# EAGLE design micon_sensor (EAGLE 9.0.0)
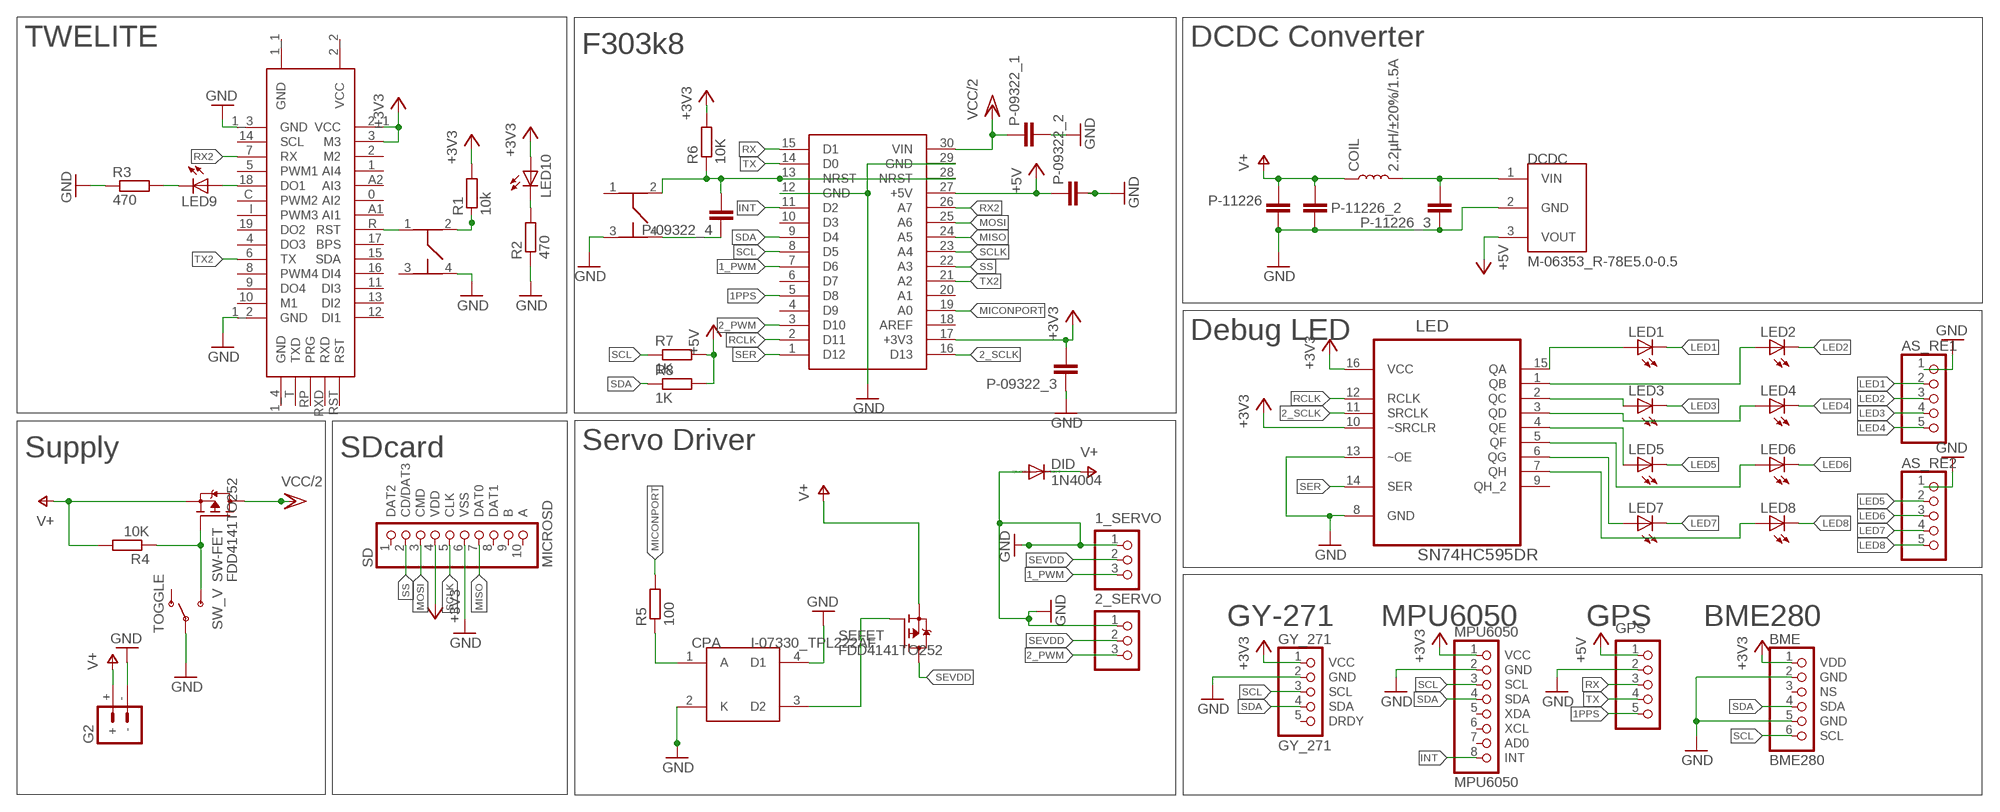
[diagram p0: schematic, sheet 1]

## Parts
1_SERVO  B3B-XH-A  [B3B-XH-A]
2_SERVO  B3B-XH-A  [B3B-XH-A]
AS_RE1  PINHD-1X5  [1X05]
AS_RE2  PINHD-1X5  [1X05]
BME  BME280  [1X06]
COIL  2.2µH/±20%/1.5A  INDUCTOR-VLF4012AT-2.2UH  [INDUCTOR_2.2UH]
CPA  I-07330_TPL222AF  [TLP222AF]
DCDC  M-06353_R-78E5.0-0.5  [R-78E5.0-0.5]
DID  1N4004  [DO41-10]
G2  BATTERY_CONN_DEANS  [DEANS]
GPS  B5B-XH-A  [B5B-XH-A]
GY_271  GY_271  [1X05]
LED  SN74HC595DR  [SOIC127P600X175-16N]
LED1  LEDCHIP-LED0603  [CHIP-LED0603]
LED2  LEDCHIP-LED0603  [CHIP-LED0603]
LED3  LEDCHIP-LED0603  [CHIP-LED0603]
LED4  LEDCHIP-LED0603  [CHIP-LED0603]
LED5  LEDCHIP-LED0603  [CHIP-LED0603]
LED6  LEDCHIP-LED0603  [CHIP-LED0603]
LED7  LEDCHIP-LED0603  [CHIP-LED0603]
LED8  LEDCHIP-LED0603  [CHIP-LED0603]
LED9  LEDCHIP-LED0603  [CHIP-LED0603]
LED10  LEDCHIP-LED0603  [CHIP-LED0603]
MPU6050  MPU6050  [1X08]
P-09322_1  C-EUC0805  [C0805]
P-09322_2  C-EUC0805  [C0805]
P-09322_3  C-EUC0805  [C0805]
P-09322_4  C-EUC0805  [C0805]
P-11226  C-EUC0805  [C0805]
P-11226_2  C-EUC0805  [C0805]
P-11226_3  C-EUC0805  [C0805]
R1  10k  R-EU_R0805  [R0805]
R2  470  R-EU_R0805  [R0805]
R3  470  R-EU_R0805  [R0805]
R4  10K  R-EU_R0805  [R0805]
R5  100  R-EU_R0805  [R0805]
R6  10K  R-EU_R0805  [R0805]
R7  1K  R-EU_R0805  [R0805]
R8  1K  R-EU_R0805  [R0805]
SD  MICROSD  [1X10]
SEFET  FDD4141TO252  [TO252]
SW-FET  FDD4141TO252  [TO252]
SW_MI  SWITCH  [SWITCH]
SW_V  TOGGLE  [320-916]
TWE_SW  SWITCH  [SWITCH]
U$1  TWELITE  [TWELITE_DIP]
U$3  STM32F303K8  [STM32F303K8]

## Nets
1_PWM: 1_SERVO.3 U$3.7(D6)
1PPS: GPS.5 U$3.5(D8)
2_PWM: 2_SERVO.3 U$3.3(D10)
2_SCLK: LED.11(SRCLK) U$3.16(D13)
+3V3: BME.1(VDD) GY_271.1(VCC) LED10.A LED.10(~SRCLR) LED.16(VCC) MPU6050.1(VCC) P-09322_3.2 R1.2 R6.2 SD.4(VDD) U$1.2_1(VCC) U$1.3(M3) U$3.17(+3V3)
+5V: DCDC.3(VOUT) GPS.1 P-09322_2.1 R7.2 R8.2 U$3.27(+5V)
GND: 1_SERVO.1 2_SERVO.1 AS_RE1.1 AS_RE2.1 BME.2(GND) BME.5(GND) CPA.2(K) CPA.4(D1) DCDC.2(GND) DID.A G2.- GPS.2 GY_271.2(GND) LED.8(GND) LED.13(~OE) MPU6050.2(GND) P-09322_1.2 P-09322_2.2 P-09322_3.1 P-11226.1 P-11226_2.1 P-11226_3.1 R2.1 R3.1 SD.6(VSS) SW_MI.3 SW_V.2 TWE_SW.4 U$1.1_2(GND) U$1.1_3(GND) U$3.12(GND) U$3.29(GND)
INT: MPU6050.8(INT) U$3.11(D2)
LED1: AS_RE1.2 LED1.C
LED2: AS_RE1.3 LED2.C
LED3: AS_RE1.4 LED3.C
LED4: AS_RE1.5 LED4.C
LED5: AS_RE2.2 LED5.C
LED6: AS_RE2.3 LED6.C
LED7: AS_RE2.4 LED7.C
LED8: AS_RE2.5 LED8.C
MICONPORT: R5.2 U$3.19(A0)
MISO: SD.7(DAT0) U$3.24(A5)
MOSI: SD.3(CMD) U$3.25(A6)
N$1: COIL.P$2 DCDC.1(VIN) P-11226_3.2
N$2: P-09322_4.2 R6.1 SW_MI.2 U$3.13(NRST) U$3.28(NRST)
N$3: P-09322_4.1 SW_MI.4
N$4: CPA.1(A) R5.1
N$5: CPA.3(D2) SEFET.1(G)
N$6: LED1.A LED.15(QA)
N$7: LED2.A LED.1(QB)
N$8: LED3.A LED.2(QC)
N$9: LED4.A LED.3(QD)
N$12: LED9.A U$1.18(DO1)
N$14: LED5.A LED.4(QE)
N$15: LED6.A LED.5(QF)
N$16: LED7.A LED.6(QG)
N$17: LED8.A LED.7(QH)
N$18: LED9.C R3.2
N$20: LED10.C R2.2
N$21: TWE_SW.1 U$1.R(RST)
N$22: R1.1 TWE_SW.2
N$36: R4.1 SW-FET.1(G) SW_V.3
RCLK: LED.12(RCLK) U$3.2(D11)
RX: GPS.3 U$3.15(D1)
RX2: U$1.7(RX) U$3.26(A7)
SCL: BME.6(SCL) GY_271.3(SCL) MPU6050.3(SCL) R7.1 U$3.8(D5)
SCLK: SD.5(CLK) U$3.23(A4)
SDA: BME.4(SDA) GY_271.4(SDA) MPU6050.4(SDA) R8.1 U$3.9(D4)
SER: LED.14(SER) U$3.1(D12)
SEVDD: 1_SERVO.2 2_SERVO.2 SEFET.3(D)
SS: SD.2(CD/DAT3) U$3.22(A3)
TX: GPS.4 U$3.14(D0)
TX2: U$1.6(TX) U$3.21(A2)
V+: COIL.P$1 DID.C G2.+ P-11226.2 P-11226_2.2 R4.2 SEFET.2(S) SW-FET.2(S)
VCC/2: P-09322_1.1 SW-FET.3(D) U$3.30(VIN)
Unconnected: BME.3(NS) GY_271.5(DRDY) LED.9(QH_2) MPU6050.5(XDA) MPU6050.6(XCL) MPU6050.7(AD0) SD.1(DAT2) SD.8(DAT1) SD.9(B) SD.10(A) SW_MI.1 SW_V.1 TWE_SW.3 U$1.0(AI2) U$1.1(AI4) U$1.1_1(GND) U$1.1_4(GND) U$1.2(M2) U$1.2_2(VCC) U$1.4(DO3) U$1.5(PWM1) U$1.8(PWM4) U$1.9(DO4) U$1.10(M1) U$1.11(DI3) U$1.12(DI1) U$1.13(DI2) U$1.14(SCL) U$1.15(SDA) U$1.16(DI4) U$1.17(BPS) U$1.19(DO2) U$1.A1(AI1) U$1.A2(AI3) U$1.C(PWM2) U$1.I(PWM3) U$1.RP(PRG) U$1.RST U$1.RXD U$1.T(TXD) U$3.4(D9) U$3.6(D7) U$3.10(D3) U$3.20(A1)

## Notes on the sheet
- TWELITE | F303k8 | DCDC Converter
- Debug LED
- Supply | SDcard | Servo Driver
- GY-271 | MPU6050 | GPS | BME280

## Power pins joined to a net without a drawn wire
AREF: U$3.18(AREF)

## Library data of the parts
1_SERVO 2_SERVO = jst-xh:B3B-XH-A: Wire-to-Board 2.5mm pitch top mount connector Source: http://www.jst-mfg.com/product/pdf/jpn/XH.pdf http://www.jst-mfg.com/product/detail.php?series=277
AS_RE1 AS_RE2 = pinhead:PINHD-1X5: PIN HEADER
BME = BME280:BME280
COIL = SparkFun-Coils:INDUCTOR: Inductors Resist changes in electrical current. Basically a coil of wire. SparkFun Products: SparkFun Load Cell Amplifier - HX711 <https://www.sparkfun.com/products/13879> IOIO-OTG - V2.2 <https://www.sparkfun.com/products/13613>; PROD_ID: NDUC-09513
CPA = Akizuki:I-07330_TPL222AF
DCDC = Akizuki:M-06353_R-78E5.0-0.5
DID = diode:1N4004: DIODE general purpose rectifier, 1 A
G2 = SparkFun-Connectors:BATTERY_CONN: Battery Connectors Various footprints for battery connections SparkFun Products: Deans Connector -M/F Pair <https://www.sparkfun.com/products/11864>; SF_ID: PRT-11864
GPS = jst-xh:B5B-XH-A: Wire-to-Board 2.5mm pitch top mount connector Source: http://www.jst-mfg.com/product/pdf/jpn/XH.pdf http://www.jst-mfg.com/product/detail.php?series=277
GY_271 = gy_271:GY_271
LED = SN74HC595DR:SN74HC595DR: 8-BIT SHIFT REGISTERS WITH 3-STATE OUTPUT REGISTERS; AVAILABILITY: Good; DESCRIPTION: 8-Bit Shift Registers With 3-State Output Registers 16-SOIC -40 to 85; MF: Texas Instruments; MP: SN74HC595DR; PACKAGE: SOIC-16 Texas Instruments; PRICE: 0.26 USD
LED1-LED10 = led:LED: LED OSRAM: - CHIPLED LG R971, LG N971, LY N971, LG Q971, LY Q971, LO R971, LY R971 LH N974, LH R974 LS Q976, LO Q976, LY Q976 LO Q996 - Hyper CHIPLED LW Q18S LB Q993, LB Q99A, LB R99A - SideLED LS A670, LO A670, LY A670, LG A670, LP A670 LB A673, LV A673, LT A673, LW A673 LH A674 LY A675 LS A676, LA A676, LO A676, LY A676, LW A676 LS A679, LY A679, LG A679 - Hyper Micro SIDELED® LS Y876, LA Y876, LO Y876, LY Y876 LT Y87S - SmartLED LW L88C, LW L88S LB L89C, LB L89S, LG L890 LS L89K, LO L89K, LY L89K LS L896, LA L896, LO L896, LY L896 - TOPLED LS T670, LO T670, LY T670, LG T670, LP T670 LSG T670, LSP T670, LSY T670, LOP T670, LYG T670 LG T671, LOG T671, LSG T671 LB T673, LV T673, LT T673, LW T673 LH T674 LS T676, LA T676, LO T676, LY T676, LB T676, LH T676, LSB T676, LW T676 LB T67C, LV T67C, LT T67C, LS T67K, LO T67K, LY T67K, LW E67C LS E67B, LA E67B, LO E67B, LY E67B, LB E67C, LV E67C, LT E67C LW T67C LS T679, LY T679, LG T679 LS T770, LO T770, LY T770, LG T770, LP T770 LB T773, LV T773, LT T773, LW T773 LH T774 LS E675, LA E675, LY E675, LS T675 LS T776, LA T776, LO T776, LY T776, LB T776 LHGB T686 LT T68C, LB T68C - Hyper Mini TOPLED® LB M676 - Mini TOPLED Santana® LG M470 LS M47K, LO M47K, LY M47K Source: http://www.osram.convergy.de LUXEON: - LUMILED® LXK2-PW12-R00, LXK2-PW12-S00, LXK2-PW14-U00, LXK2-PW14-V00 LXK2-PM12-R00, LXK2-PM12-S00, LXK2-PM14-U00 LXK2-PE12-Q00, LXK2-PE12-R00, LXK2-PE12-S00, LXK2-PE14-T00, LXK2-PE14-U00 LXK2-PB12-K00, LXK2-PB12-L00, LXK2-PB12-M00, LXK2-PB14-N00, LXK2-PB14-P00, LXK2-PB14-Q00 LXK2-PR12-L00, LXK2-PR12-M00, LXK2-PR14-Q00, LXK2-PR14-R00 LXK2-PD12-Q00, LXK2-PD12-R00, LXK2-PD12-S00 LXK2-PH12-R00, LXK2-PH12-S00 LXK2-PL12-P00, LXK2-PL12-Q00, LXK2-PL12-R00 Source: www.luxeon.com KINGBRIGHT: KA-3528ASYC Source: www.kingbright.com
MPU6050 = mpu6050_dip:MPU6050
P-09322_1-P-09322_4 P-11226 P-11226_2 P-11226_3 = resistor:C-EU: CAPACITOR, European symbol
R1-R8 = resistor:R-EU_: RESISTOR, European symbol
SD = microsd_dip:MICROSD
SEFET SW-FET = transistor-fet:FDD4141: P-Channel PowerTrench® MOSFET Source: FDD4141.pdf
SW_MI TWE_SW = tactswitch_akitsuki:SWITCH
SW_V = toggle_switch:TOGGLE
U$1 = twe_lite_dip:TWELITE
U$3 = stm32f303k8:STM32F303K8

## Net classes
0 default: drill 0.152 mm, clearance 0.254 mm

## Board
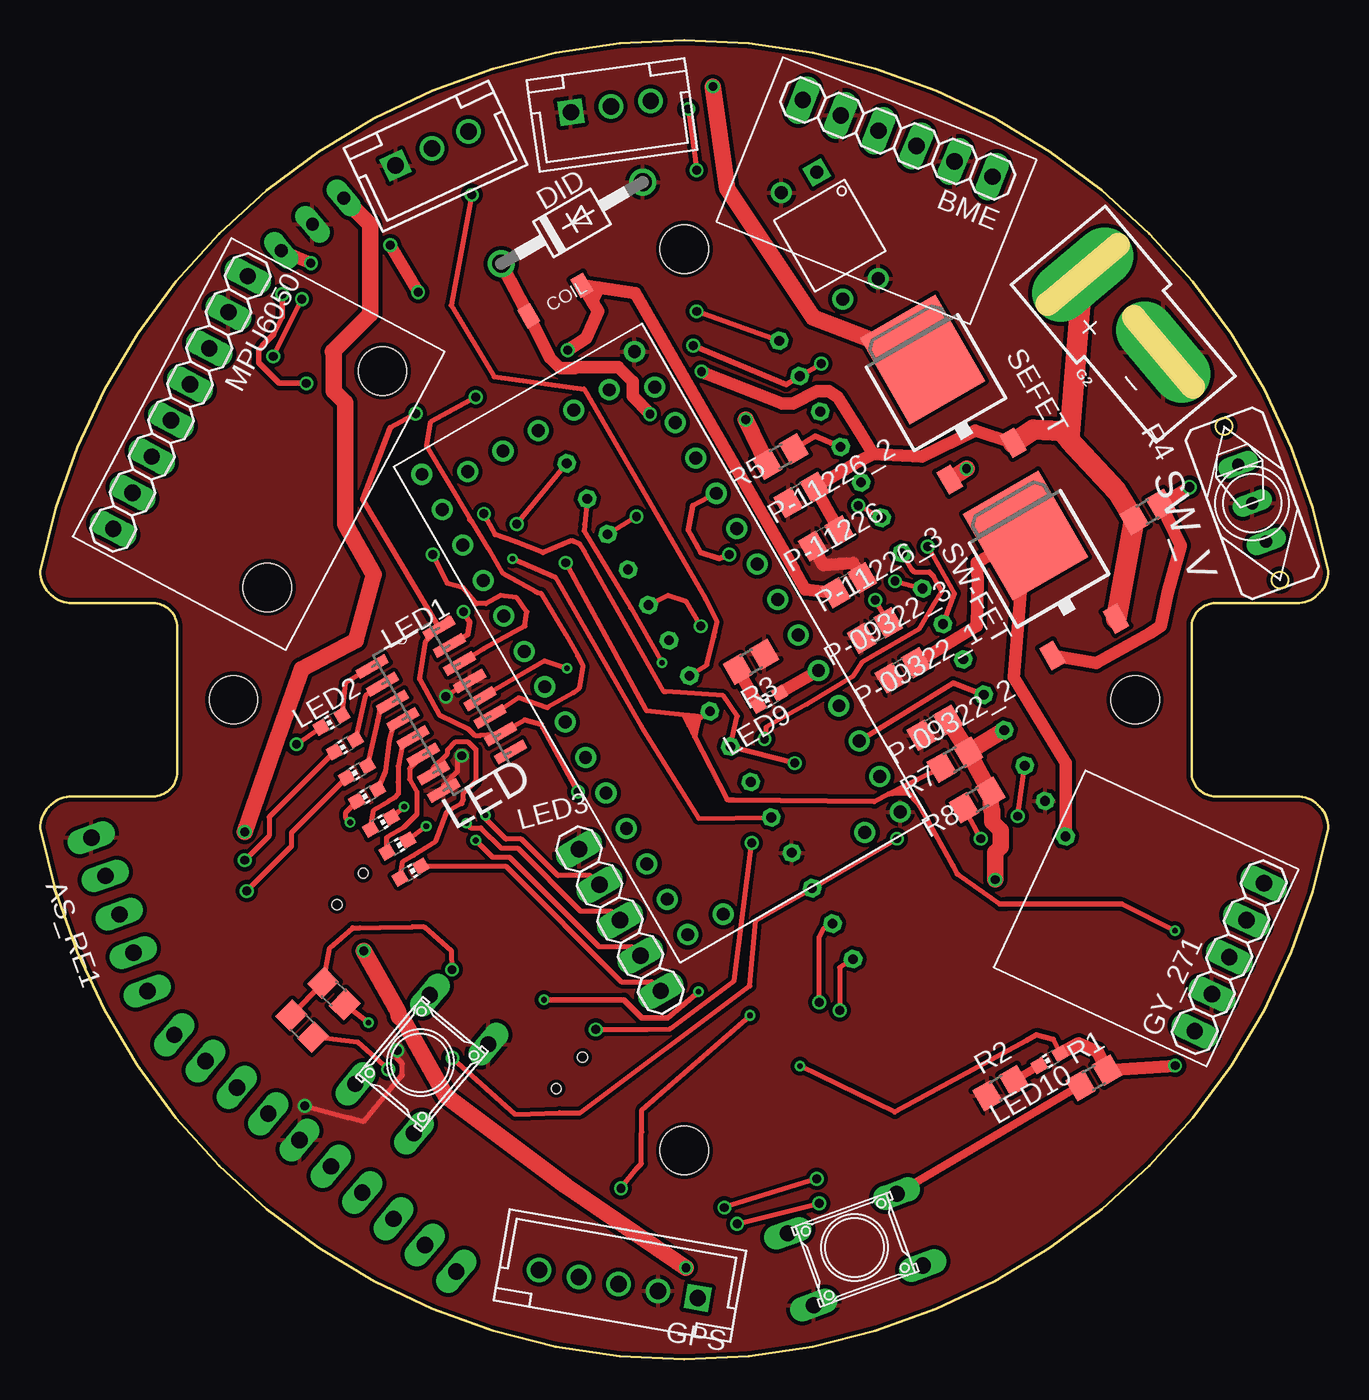
[diagram p1: board, top side]
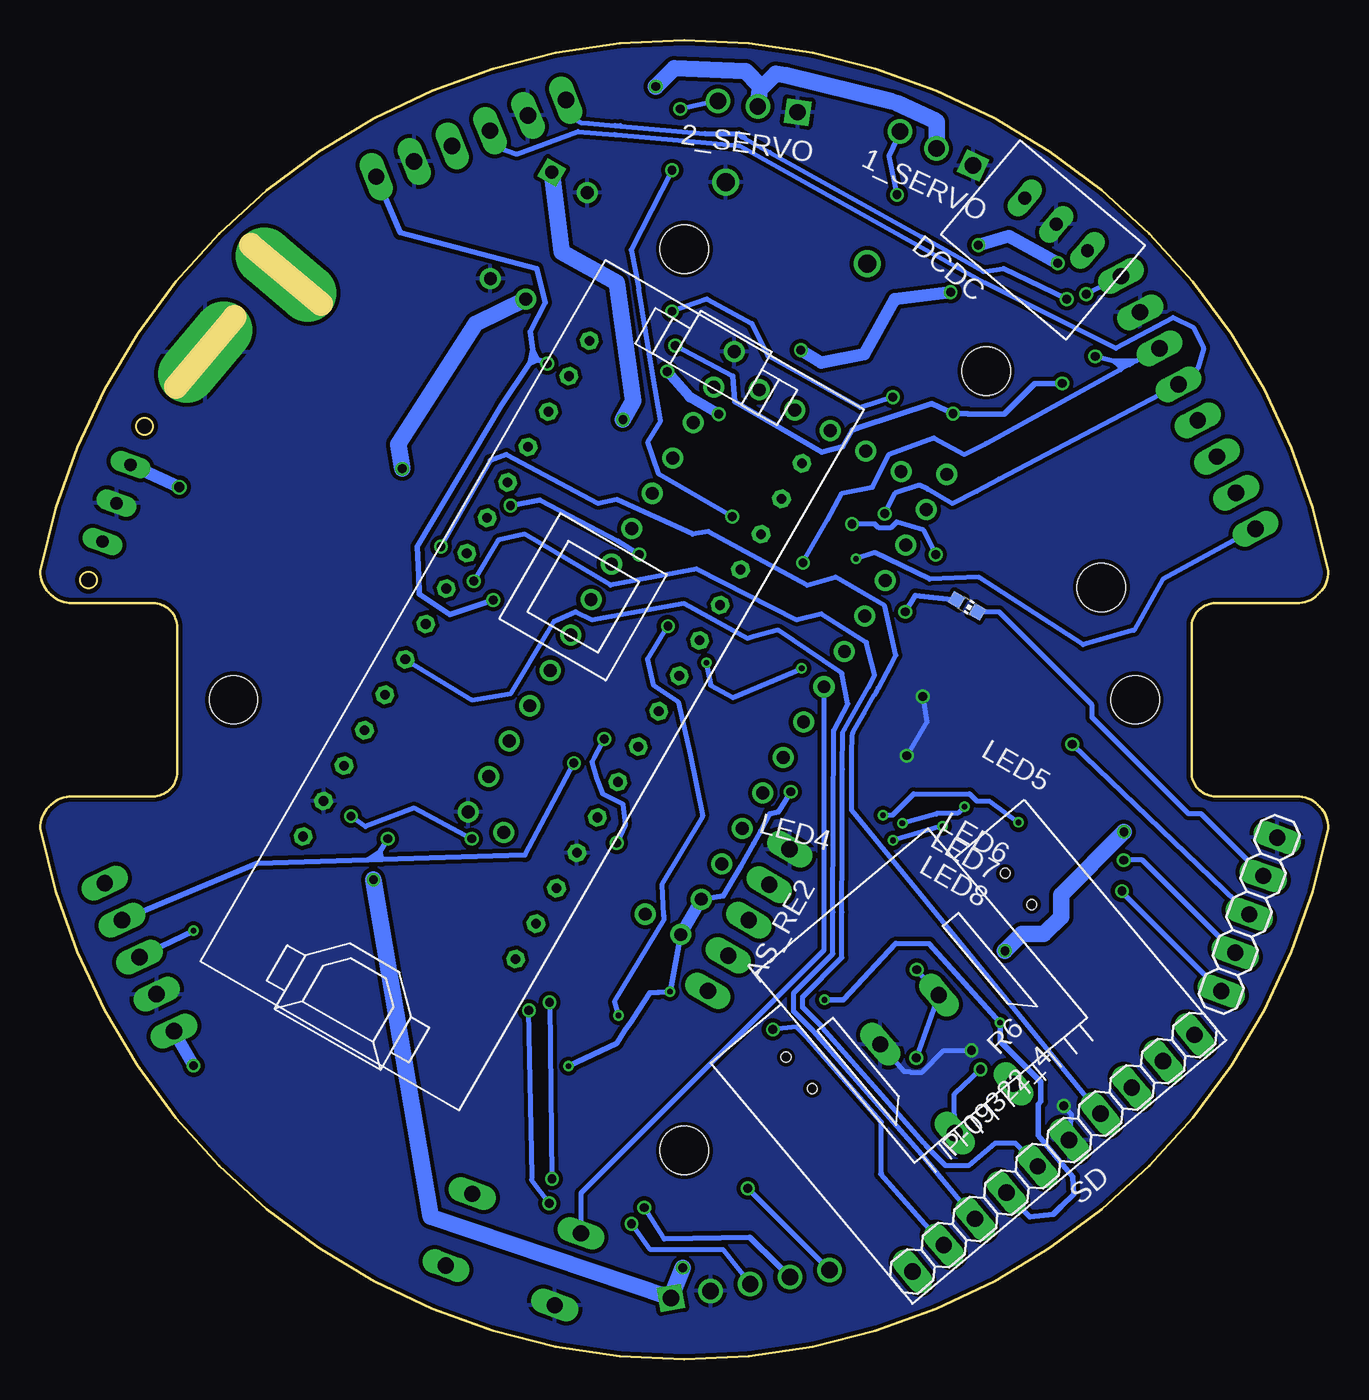
[diagram p2: board, bottom side, seen from below]

Size 80 x 81.95 mm. Coordinates in mm from the lower left corner, seen from the top.
Outline: 0,48.97 arc-158 80,48.97 arc-90 78,46.97 73,46.97 arc90 71.5,45.47 71.5,36.47 arc90 73,34.97 78,34.97 arc-90 80,32.97 arc-158 0,32.97 arc-90 2,34.97 7,34.97 arc90 8.5,36.47 8.5,45.47 arc90 7,46.97 2,46.97 arc-90 0,48.97
Copper layers (1*16): Top 0.035mm / dielectric 1.5mm / Bottom 0.035mm
Design rules "SeeedStudio_2layer_DRU_no_angle_20140221": minimum track width 6mil, minimum drill 12mil, track to track 6mil, track to pad 6mil, pad to pad 6mil, via to via 6mil, smd to smd 0mil, copper to edge 10mil, drill to drill 10mil, minimum pad ring 10mil, minimum via ring 6mil, stop-mask expansion 2mil, vias tented up to drill 100mil, thermal gap 10mil
Holes 3 mm at 40,68.97 12,40.97 40,12.97 68,40.97

### Footprints (pad centres in the part's own frame; a part is rotated, then mirrored left to right if it is on the bottom)
B3B-XH-A = drill 1.016 square: 1 -2.5,0 | drill 1.016: 2 0,0; 3 2.5,0
1X05 = drill 1.016 long: 1 -5.08,0; 2 -2.54,0; 3 0,0; 4 2.54,0; 5 5.08,0
1X06 = drill 1.016 long: 1 -6.35,0; 2 -3.81,0; 3 -1.27,0; 4 1.27,0; 5 3.81,0; 6 6.35,0
INDUCTOR_2.2UH = smd 0.9 x 1.3: P$1 -1.9,0; P$2 1.9,0
TLP222AF = drill 0.8 square: 1 0,0 | drill 0.8: 2 0,-2.54; 3 7.62,-2.54; 4 7.62,0
R-78E5.0-0.5 = drill 0.8 long: 1 0,0; 2 2.54,0; 3 5.08,0
DO41-10 = drill 1.118: A 5.08,0; C -5.08,0
DEANS = drill 1.27 pad 3.556 long: + 0,0; - 0.737,-6.921
B5B-XH-A = drill 1.016 square: 1 -5,0 | drill 1.016: 2 -2.5,0; 3 0,0; 4 2.5,0; 5 5,0
SOIC127P600X175-16N = smd 2.057 x 0.61: 1 -4.801,8.89; 2 -4.801,7.62; 3 -4.801,6.35; 4 -4.801,5.08; 5 -4.801,3.81; 6 -4.801,2.54; 7 -4.801,1.27; 8 -4.801,0; 9 0,0; 10 0,1.27; 11 0,2.54; 12 0,3.81; 13 0,5.08; 14 0,6.35; 15 0,7.62; 16 0,8.89
CHIP-LED0603 = smd 0.8 x 0.8: A 0,-0.75; C 0,0.75
1X08 = drill 1.016 long: 1 -8.89,0; 2 -6.35,0; 3 -3.81,0; 4 -1.27,0; 5 1.27,0; 6 3.81,0; 7 6.35,0; 8 8.89,0 | hole 3: -7.62,10.16; 7.62,10.16
C0805 = smd 1.3 x 1.5: 1 -0.95,0; 2 0.95,0
R0805 = smd 1.3 x 1.5: 1 -0.95,0; 2 0.95,0
1X10 = drill 1.016 long: 1 -11.43,0; 2 -8.89,0; 3 -6.35,0; 4 -3.81,0; 5 -1.27,0; 6 1.27,0; 7 3.81,0; 8 6.35,0; 9 8.89,0; 10 11.43,0 | hole 0.6: -8.89,12.7; 8.89,12.7; -8.89,15.24; 8.89,15.24
TO252 = smd 1 x 1.6: 1 -2.28,-4.8; 2 2.28,-4.8 | smd 5.4 x 6.2: 3 0,2.5
SWITCH = drill 1 long: 1 -3.6,2.25; 2 3.6,2.25; 3 3.6,-2.5; 4 -3.6,-2.5
320-916 = drill 0.762 long: 1 0,2.54; 2 0,0; 3 0,-2.54
TWELITE_DIP = drill 0.8: 0 7.62,3.81; 1 7.62,8.89; 1_1 -5.08,16.51; 1_2 -7.62,-16.51; 1_3 -7.62,16.51; 1_4 -5.08,-15.24; 2 7.62,11.43; 2_1 7.62,16.51; 2_2 5.08,16.51; 3 7.62,13.97; 4 -7.62,-3.81; 5 -7.62,8.89; 6 -7.62,-6.35; 7 -7.62,11.43; 8 -7.62,-8.89; 9 -7.62,-11.43; 10 -7.62,-13.97; 11 7.62,-11.43; 12 7.62,-16.51; 13 7.62,-13.97; 14 -7.62,13.97; 15 7.62,-6.35; 16 7.62,-8.89; 17 7.62,-3.81; 18 -7.62,6.35; 19 -7.62,-1.27; A1 7.62,1.27; A2 7.62,6.35; C -7.62,3.81; I -7.62,1.27; R 7.62,-1.27; RP 0,-15.24; RST 5.08,-15.24; RXD 2.54,-15.24; T -2.54,-15.24
STM32F303K8 = drill 0.6 octagon: 1 -7.62,-20.32; 2 -7.62,-17.78; 3 -7.62,-15.24; 4 -7.62,-12.7; 5 -7.62,-10.16; 6 -7.62,-7.62; 7 -7.62,-5.08; 8 -7.62,-2.54; 9 -7.62,0; 10 -7.62,2.54; 11 -7.62,5.08; 12 -7.62,7.62; 13 -7.62,10.16; 14 -7.62,12.7; 15 -7.62,15.24; 16 7.62,-20.32; 17 7.62,-17.78; 18 7.62,-15.24; 19 7.62,-12.7; 20 7.62,-10.16; 21 7.62,-7.62; 22 7.62,-5.08; 23 7.62,-2.54; 24 7.62,0; 25 7.62,2.54; 26 7.62,5.08; 27 7.62,7.62; 28 7.62,10.16; 29 7.62,12.7; 30 7.62,15.24

### Placement (x,y rotation side)
1_SERVO  24.33,75.21 25 top
2_SERVO  35.44,77.83 8 top
AS_RE1  4.92,27.64 250 bottom
AS_RE2  36,27.28 300 top
BME  53.24,75.85 158 top
COIL  31.99,65.78 30 top
CPA  48.23,73.74 300 top
DCDC  14.96,68.88 140 bottom
DID  33.02,70.59 30 top
G2  64.74,67.39 40 top
GPS  35.91,4.68 170 top
GY_271  73.84,24.98 65 top
LED  29.21,37.74 30 top
LED1  22.45,46.8 240 bottom
LED2  18.09,39.63 120 top
LED3  18.91,38.11 120 top
LED4  19.66,36.5 120 top
LED5  20.3,35.04 120 top
LED6  21.15,33.3 300 top
LED7  22.18,31.88 300 top
LED8  23,30.27 300 top
LED9  45.26,41.01 120 top
LED10  62.69,18.62 120 top
MPU6050  8.71,59.44 242 top
P-09322_1  53.57,42.8 210 top
P-09322_2  55.55,39.24 210 top
P-09322_3  51.84,45.27 30 top
P-09322_4  16.27,20.69 135 top
P-11226  48.8,51 30 top
P-11226_2  47.27,53.7 30 top
P-11226_3  50.23,48.08 210 top
R1  65.43,17.48 30 top
R2  59.65,16.84 30 top
R3  44.14,43.33 210 top
R4  68.76,52.64 210 top
R5  45.97,56.08 30 top
R6  18.23,22.71 315 top
R7  56.8,37.24 30 top
R8  58.19,34.75 30 top
SD  17.08,12.8 40 bottom
SEFET  56.05,59.95 30 top
SW-FET  62.44,49.02 30 top
SW_MI  23.6,18.42 50 top
SW_V  75.26,53.18 200 top
TWE_SW  50.57,6.94 20 top
U$1  38.56,44.49 210 top
U$3  49.46,41.87 150 bottom

### Tracks (layer width: path | path; a pad name or v marks a point on that pad's centre or on a via)
1_PWM  (via drill 0.55)
  Top 0.305: U$3.7 41.4,43.13 41.83,44.9 41.9,45.18 42.03,45.8 41.32,47.22 | 41.32,47.22 41.27,47.32 | v26.79,72.34 25.52,65.48 28.19,61.04 33.78,60.28 41.32,47.22
  Bottom 0.305: 1_SERVO.3 27.3,74.76 v26.79,72.34
1PPS  (via drill 0.35, 0.55)
  Top 0.305: v36.06,10.62 37.08,11.89 37.33,12.14 37.33,14.08 37.36,14.11 37.36,15.5 v44.09,21.36 | v41.02,45.55 40.13,47.07 38.98,47.45 U$3.5
  Bottom 0.305: GPS.5 v36.06,10.62 | v41.02,45.55 42.29,43.51 41.91,41.86 40.38,40.85 39.62,37.54 38.86,33.73 41.4,29.49 41.29,27.56 41.28,27.55 41.28,27.31 44.34,22.23 v44.09,21.36
2_PWM  (via drill 0.55)
  Top 0.305: v40.25,77.68 v40.76,73.87 | U$3.3 v37.03,52.35
  Bottom 0.305: v40.76,73.87 43.3,68.91 42.82,66.52 41.97,61.18 41.47,58.3 42.26,56.98 41.6,54.99 v37.03,52.35 | 2_SERVO.3 v40.25,77.68
2_SCLK  (via drill 0.55)
  Top 0.305: v27.05,59.77 24.25,58.25 24,56.72 26.67,52.27 26.67,52.16 26.83,52.01 27.81,50.37 28.7,48.85 30.76,47.69 30.89,47.62 31.11,47.58 32.63,45.04 33.37,43.72 33.71,43.06 33.49,41.71 33.09,41.41 31.49,40.49 29.71,41.1 LED.11 | v40.76,65.1 U$3.16
  Bottom 0.305: v27.05,59.77 29.08,59.13 34.79,62.31 35.81,64.34 38.6,65.87 v40.76,65.1
+3V3  (via drill 0.35, 0.55)
  Top 0.305: 25.4,46.07 LED.16 23.94,44.61 23.56,42.26 24.8,40 26.61,39.14 27.02,38.72 27.28,38.72 27.3,38.74 LED.10
  Top 0.356: LED.10 30.09,39.7 31.11,39.45 31.22,39.24 v33.4,35.26 | v20.39,20.91 R6.2 | v31.29,22.33 36.24,22.33 37.35,21.22 38.97,21.22 v40.89,22.83 | LED10.A 62.9,19.88 61.87,20.15 61.28,19.83 53.08,15.37 v47.19,18.22 | v48.51,61.85 48.51,61.83 U$3.17 46.32,60.55 v40.56,62.97 | v51.86,47.17 P-09322_3.2 | LED.16 20.04,53.42 21.74,57.89 v23.31,58.75 | v16.53,60.63 16.52,60.64 14.86,60.64 13.56,61.93 13.56,62.69 13.79,62.91 13.79,62.98 14.51,63.7 15.03,64.73 v15.03,66.17
  Top 0.762: v70.48,18.24 R1.2 65.65,19.13 64.51,19.64 LED10.A
  Bottom 0.356: v33.4,35.26 33.98,34.29 34.16,33.99 34.7,33.88 35.24,32.83 35.69,32.05 36.51,30.63 36.96,29.85 37.59,28.78 U$1.3 | SD.4 18.54,8.84 17.09,8.99 16.58,9.5 15.82,10.24 15.87,11.33 18.03,13.92 18.03,15.85 17.86,16.02 17.86,17.22 20.39,19.76 v20.39,20.91 24.79,25.81 26.87,25.84 30.14,22.33 v31.29,22.33 | U$1.2_1 v40.89,22.83 41.6,22.79 42.16,22.77 43.18,21.19 43.28,21.03 43.69,20.43 44.19,19.63 v47.19,18.22 | BME.1 57.65,69.98 49.17,67.76 48.65,65.66 49.58,63.86 49.42,62.71 | v48.51,61.85 49.11,62.11 | 49.11,62.11 49.35,62.21 49.36,62.26 | 49.36,62.26 49.42,62.71 | 51.25,59.44 51.38,59.23 | 51.38,59.23 56.59,50.5 56.48,48.67 56.46,47.53 54.58,46.26 v51.86,47.17 | v40.56,62.97 37,61.09 36.88,59.49 31.47,56.37 30.17,56.7 29.59,57.71 29.08,57.92 24.63,59.36 v23.31,58.75 22.42,58.75 22.37,58.71 20.14,58.71 18.24,60.61 16.61,60.61 v16.53,60.63 | MPU6050.1 v15.03,66.17 | 51.38,59.23 49.6,61.89 | 49.6,61.89 49.56,61.96 | 49.56,61.96 49.36,62.26 | 49.11,62.11 49.6,61.89 | 49.11,62.11 49.42,62.71 | 49.42,62.71 49.56,61.96
  Bottom 0.762: GY_271.1 v70.48,18.24 | U$1.3 U$1.2_1
+5V  (via drill 0.55)
  Top 1.016: P-09322_2.1 R7.2 | U$3.27 R7.2 | R7.2 R8.2 59.08,34.13 59.12,34.09 59.12,33.39 59.66,32.85 59.66,31.82 59.3,31.47 v59.3,29.8 | v40.1,5.69 32.63,10.77 25.19,16.36 22.54,21.05 22.25,21.29 22.23,21.6 v20.09,25.38 | v12.7,32.77 14.54,38.04 16.23,42.88 19.61,44.65 20.72,48.75 18.96,51.9 18.96,59.43 18.23,60.15 | DCDC.3 20.5,70.5 20.5,64.92 18.17,62.6 18.23,62.54 18.23,60.15 | 18.23,60.15
  Bottom 1.016: v59.3,29.8 55.75,8.84 GPS.1 v40.1,5.69 | v20.09,25.38 19.04,26.42 17.67,26.42 16.61,27.49 16.61,28.86 v12.7,32.77
GND  (via drill 0.55)
  Top 0.305: v22.16,19.19 22.16,18.71 22.5,18.38 22.5,17.65 22.13,17.28 20.06,14.76 19.15,15.01 v16.43,15.75 | LED.13 v25.19,41.18 | v26.18,37.49 25.9,37.21 25.9,36.51 25.06,35.66 LED.8
  Top 0.762: P-11226.1 48.64,49.36 50.49,49.46 P-11226_3.1
  Bottom 0.305: v22.16,19.19 23.88,19.19 25.23,17.84 25.96,17.84 26.01,17.88 26.36,17.88 SW_MI.3 | v25.19,41.18 24.94,39.58 v26.18,37.49 | v16.43,15.75 15.94,15.2 SD.6
  pour Top (isolate 0.254): -1.15,82.38 -0.77,-0.81 70.86,-0.68 80.13,-0.68 80.39,82.5
  pour Bottom (isolate 0.254): -1.15,81.66 -1.15,-0.83 80.21,-0.83 80.21,82.5 -0.82,82.5 -1.15,82.17 -1.15,81.69
INT  (via drill 0.35)
  Top 0.305: v29.33,49.74 32,48.59 37.33,39.32 40.89,33.61 U$3.11
  Bottom 0.305: MPU6050.8 10.28,48.47 12.06,45.29 15.23,44.4 21.71,48.59 24.76,48.47 28.19,50.12 v29.33,49.74
LED1
  Bottom 0.305: LED1.C 20.45,46.43 14.67,40.65 14.67,39.87 8.68,33.88 7.91,33.88 AS_RE1.2
LED2  (via drill 0.55)
  Top 0.305: v15.91,38.21 LED2.C
  Bottom 0.305: AS_RE1.3 v15.91,38.21
LED3  (via drill 0.55)
  Top 0.305: v12.71,31 14.22,32.52 14.22,33.69 LED3.C
  Bottom 0.305: AS_RE1.4 11.55,31.02 12.72,31.02 v12.71,31
LED4  (via drill 0.55)
  Top 0.305: LED4.C 15.62,32.73 15.62,31.88 v12.82,29.09
  Bottom 0.305: v12.82,29.09 12.82,29.03 AS_RE1.5
LED5  (via drill 0.35)
  Top 0.305: AS_RE2.2 34.16,30.05 32.14,30.05 29.87,32.32 28.92,32.32 27.66,33.58 v27.66,33.81 | v19.25,33.35 18.98,33.63 18.98,33.98 LED5.C
  Bottom 0.305: v27.66,33.81 27.07,33.81 25.75,35.12 22.28,35.12 21.83,34.67 21.05,34.67 v19.25,33.35
LED6  (via drill 0.35)
  Top 0.305: LED6.C v22.6,34.34 | v26.46,33.3 26.74,33.02 27.37,33.02 28.63,31.76 29.64,31.76 33.55,27.85 35.44,27.85 AS_RE2.3
  Bottom 0.305: v26.46,33.3 24.33,33.87 24.3,33.91 23.03,33.91 v22.6,34.34
LED7  (via drill 0.35)
  Top 0.305: LED7.C v23.97,33.12 | v27.05,32.24 28.08,31.2 29.13,31.2 34.68,25.65 36.7,25.65 AS_RE2.4
  Bottom 0.305: v23.97,33.12 v27.05,32.24
LED8
  Top 0.305: AS_RE2.5 37.98,23.45 36.09,23.45 28.9,30.64 LED8.C
MICONPORT
  Top 0.356: R5.2 48.13,57.36 U$3.19
MISO  (via drill 0.55)
  Top 0.305: v55.11,50.5 56.76,47.58 U$3.24
  Bottom 0.305: 28.1,41.43 28.17,41.28 28.19,41.27 28.84,40.13 29.53,38.94 29.59,38.69 29.62,37.67 29.62,34.12 SD.7 | 28.1,41.43 28.08,41.47 27.97,41.66 | 27.97,41.66 27.98,41.68 27.97,41.69 | 28.1,41.43 28.05,41.53 27.97,41.66 | 27.97,41.66 27.17,43.13 26.87,43.74 27.55,46.82 30.6,48.59 30.63,48.59 32.38,48.09 38.5,51.43 39.49,51.26 44.19,53.42 45.33,53.17 51.05,56.21 52.06,55.83 v55.11,50.5
MOSI
  Bottom 0.305: SD.3 25.39,12.91 32,20.4 33.21,21.61 33.21,22.75 30.77,25.19 30.77,27.77 30.73,39.07 29.84,40.72 30.22,42.62 31.39,43.41 34.16,45.29 35.68,44.91 36.06,44.78 40,46.94 45.72,45.93 46.73,46.43 48.13,45.8 48.51,45.16 50.8,41.35 53.21,40.97 U$3.25
N$1  (via drill 0.55)
  Top 0.356: 46.86,48.97 46.85,48.98 46.78,49.12 46.75,49.18
  Top 0.762: 46.78,49.12 42.25,57.01 36.95,66.25 34.7,66.57 | 34.7,66.57 COIL.P$2 34.26,65.74 | v32.76,62.69 33.9,63.45 34.67,65.1 34.26,65.74 | 34.7,66.57 34.26,65.74 | P-11226_3.2 47.52,47.83 46.86,48.97 | v23.46,66.3 v21.74,69.22 | DCDC.1 v16.81,68.1
  Bottom 0.762: v23.46,66.3 26.92,65.87 28.82,62.44 31.49,61.93 v32.76,62.69 | v16.81,68.1 19.86,69.78 v21.74,69.22
N$2  (via drill 0.55)
  Top 0.305: v53.21,32.34 U$3.13 44.45,27.26 44.06,23.19 33.52,15.32 32.25,15.31 29.48,15.22 v25.6,18.72 | v60.7,33.73 U$3.28 | P-09322_4.2 R6.1 17.97,25.54 19.4,26.8 19.86,26.8 21.1,26.83 23.08,26.85 23.85,26.85 25.56,25.35 v25.57,24.21
  Bottom 0.305: v53.21,32.34 56.76,34.24 59.81,33.1 v60.7,33.73 | v25.6,18.72 SW_MI.2 v25.57,24.21
N$3  (via drill 0.55)
  Top 0.305: v21.61,18.01 19.73,19.69 P-09322_4.1
  Bottom 0.305: SW_MI.4 23.24,16.49 v21.61,18.01
N$4  (via drill 0.55)
  Top 1.016: v43.81,58.37 R5.1
  Bottom 1.016: CPA.1 47.62,68.79 44.19,66.88 43.17,59.52 v43.81,58.37
N$5  (via drill 0.55)
  Top 1.016: SEFET.1 v57.53,55.32
  Bottom 1.016: v57.53,55.32 57.78,56.85 52.95,64.34 CPA.3
N$6  (via drill 0.55)
  Top 0.356: v26.28,46.43 26.64,45.84 26.66,45.8 26.54,45.04 LED.15
  Bottom 0.356: LED1.A 25.65,47.45 v26.28,46.43
N$7
  Top 0.305: LED.1 18.94,42.01 LED2.A
N$8
  Top 0.305: LED.2 20.19,41.23 LED3.A
N$9
  Top 0.305: LED.3 21.08,40.36 20.95,39.7 LED4.A
N$12
  Top 0.762: LED9.A U$1.18
N$14
  Top 0.305: LED.4 21.89,39.27 21.68,38.49 21.43,36.5 LED5.A
N$15
  Top 0.305: LED.5 22.47,38.13 22.22,36.83 22.22,35.84 22.25,35.82 22.25,35.15 21.97,34.88 21.67,34.71 21.67,34.7 20.71,34.11 LED6.A
N$16
  Top 0.305: LED7.A 21.53,32.37 21.51,32.39 21.6,32.48 22.59,33.05 23.39,33.85 23.39,35.25 22.94,36.02 22.94,36.69 LED.6
N$17
  Top 0.305: LED8.A 22.52,30.92 23.2,31.32 24.56,32.19 25.24,34 26.18,34.52 26.28,34.75 26.28,35.16 27.07,35.94 27.07,37.86 26.55,38.38 25.82,38.38 25.3,37.86 25.3,37.64 24.42,36.76 LED.7
N$18
  Top 0.762: R3.2 LED9.C
N$20
  Top 0.508: R2.2 LED10.C
N$21
  Bottom 0.305: TWE_SW.1 46.41,10.33 31.32,25.42 U$1.R
N$22
  Top 0.508: R1.1 TWE_SW.2
N$36  (via drill 0.6)
  Top 0.762: v71.37,54.18 R4.1 70.84,50.55 70.03,47.63 69.59,45.55 68.95,45.12 65.57,43.25 SW-FET.1
  Bottom 0.762: v71.37,54.18 SW_V.3
RCLK  (via drill 0.35)
  Top 0.305: LED.12 31.31,43.39 v32.71,42.93 | U$3.2 33.8,51.87 33.78,51.46 36.67,46.69 v38.62,43.27
  Bottom 0.305: v38.62,43.27 38.37,41.86 36.98,41.1 v32.71,42.93
RX  (via drill 0.55)
  Top 0.305: U$3.15 49.65,24.34 v49.65,21.67 | v43.28,8.41 v48.38,9.68
  Bottom 0.305: 35.94,4.68 GPS.3 37.59,6.81 42.11,6.81 v43.28,8.41 | v49.65,21.67 49.45,11.38 49.46,11.13 v48.38,9.68
RX2
  Top 0.356: U$3.26 56.69,42 U$1.7
SCL  (via drill 0.35, 0.55)
  Top 0.305: v32.63,49.48 37.6,40.37 37.65,40.28 39.96,40.03 | 43.05,34.75 42.65,34.77 40.63,38.69 | 40.84,39.53 40.91,39.8 41.05,39.9 | 40.84,39.53 40.79,39.31 40.63,38.69 | U$3.8 41.05,39.9 | 41.05,39.9 40.63,39.95 | 40.63,39.95 40.33,39.98 | 40.33,39.98 40.25,39.99 39.96,40.03 | v16.25,65.87 v14.47,62.31 | 40.63,39.95 40.84,39.53 | 40.63,38.69 40.29,39.37 | 40.29,39.37 40.18,39.58 | 40.18,39.58 39.96,40.03 | 40.54,38.88 40.65,39.57 | 40.65,39.57 40.69,39.84 40.29,39.37 | 40.18,39.58 40.33,39.98 | 40.33,39.98 40.65,39.57 | 56.96,30.14 59.6,28.29
  Top 0.356: v70.48,26.62 67.18,28.27 59.94,28.27 59.6,28.29 | 56.96,30.14 56.66,30.68 55.11,33.48 54.51,34.57 54.49,34.57 53.9,35.17 | 42.79,34.75 43.05,34.75 51.81,34.65 52.71,35.11 | R7.1 54.48,36.02 53.67,35.61 | 53.9,35.17 53.59,35.17 | 53.59,35.17 53.19,35.17 52.71,35.11 | 52.71,35.11 53.67,35.61 | 53.67,35.61 53.9,35.17 | 53.67,35.61 53.59,35.17
  Bottom 0.305: MPU6050.3 11.92,62.03 | 11.92,62.03 12.17,61.89 12.36,61.78 | 12.36,61.78 12.91,61.48 | 12.91,61.48 21.18,56.93 | 21.18,56.93 21.33,56.85 | 21.18,56.93 22.6,56.21 24.51,57.23 27.3,56.21 28.32,54.18 30.22,53.8 31.11,52.15 v32.63,49.48 | BME.6 46.98,77.17 46.44,76.83 45.95,76.78 44.31,76.64 43.98,76.64 43.95,76.61 38.72,76.14 36.61,76.14 36.4,75.94 36.29,75.93 36.21,75.83 34.67,74.97 | 34.67,74.97 | 34.67,74.97 25.29,69.73 21.44,67.58 20.19,67.77 v16.25,65.87 | v14.47,62.31 13.37,62.03 | 13.37,62.03 12.68,61.86 | 12.68,61.86 12.36,61.78 | 12.68,61.86 12.84,61.61 | 12.84,61.61 12.91,61.48 | 13.31,62.02 12.84,61.61 | 13.37,62.03 11.92,62.03
  Bottom 0.356: GY_271.3 v70.48,26.62
SCLK  (via drill 0.55)
  Top 0.305: v53.08,48.34 U$3.23
  Bottom 0.305: SD.5 19.43,13.41 20.7,13.41 22.35,12.02 23.77,12.02 24.58,12.83 | 24.58,12.83 24.75,13 | 24.58,12.83 24.82,13.1 24.97,13.27 25.11,13.44 25.12,13.44 27.49,16.13 31.44,20.61 31.44,20.65 32.65,21.86 32.65,22.52 30.21,24.96 30.21,27.76 30.2,31.7 | 30.2,31.7 | 30.2,31.7 30.18,36.65 30.17,38.93 30.05,39.15 28.57,41.74 28.19,42.5 28.7,44.53 31.49,46.31 33.02,45.93 39.24,49.1 44.57,48.09 49.91,51.26 51.56,50.88 v53.08,48.34
SDA  (via drill 0.55)
  Top 0.305: U$3.9 43.3,39.96 42.41,41.23 38.86,41.48 38.73,41.48 33.79,50.2 33.52,50.63 33,50.85 31.24,50.12 29.52,50.79 28.25,51.22 27.76,52.12 v27.55,52.53
  Top 0.356: U$3.9 v46.86,37.04 | R8.1 v58.41,32.34
  Bottom 0.305: v27.55,52.53 26.92,53.8 25.39,54.31 24.89,54.05 23.36,53.17 21.84,53.93 20.44,54.69 MPU6050.4 8.12,61.55 7.74,62.82 8.38,64.09 9.65,64.72 13.2,62.82 21.33,66.88 36.57,75.39 44.2,76.07 44.34,76.08 46.6,76.28 50.41,74.88 51.56,75.26 BME.4
  Bottom 0.356: v46.86,37.04 49.91,31.32 58.79,31.05 | 58.79,31.05 59.18,31.04 | 59.18,31.04 59.68,31.02 | 59.68,31.02 66.54,30.81 GY_271.4 | v58.41,32.34 58.9,31.51 | 58.9,31.51 59.18,31.04 | 58.9,31.51 58.79,31.05 | 58.9,31.51 59.68,31.02
SER  (via drill 0.55)
  Top 0.305: LED.14 27.55,44.15 30.09,45.55 30.22,46.43 29.59,47.32 28.57,47.45 27.68,46.94 27.08,46.94 26.94,47.09 26.2,47.98 25.27,48.21 v24.38,49.99 | v29.59,51.9 U$3.1
  Bottom 0.305: v29.59,51.9 28.17,51.9 27.92,51.65 27.19,51.65 26.81,52.02 25.14,51.51 v24.38,49.99
SEVDD  (via drill 0.55)
  Top 1.016: v41.78,79.07 42.67,72.72 48,64.72 SEFET.3
  Bottom 1.016: 2_SERVO.2 35.31,78.87 | 35.31,78.87 34.33,79.86 33.69,79.77 27.16,78.15 | 1_SERVO.2 24.33,76.88 24.41,76.96 | 24.41,76.96 | 24.41,76.96 26.77,78.04 27.16,78.15 | 27.16,78.15 | 35.31,78.87 35.31,79.13 36.2,80.02 40.63,80.22 v41.78,79.07
SS  (via drill 0.55)
  Top 0.305: v34.5,20.49 37.71,20.49 39.11,20.53 43.09,23.49 v44.19,32.08 | U$3.22 54.1,49.1 54.29,48.91 55.21,48.91 55.48,48.64 55.48,48.61 55.49,48.59 56,47.7 55.48,46.89 54.58,45.37 51.05,43.31 50.47,42.42 47.62,40.69 45.08,39.27 v44.98,38.54
  Bottom 0.305: SD.2 27.81,11.51 27.76,11.56 27.76,14.74 | 27.76,14.74 | 27.76,14.74 32.41,20.02 33.03,20.64 v34.5,20.49 | v44.19,32.08 43.68,33.23 43.81,34.5 45.08,35.13 45.46,36.15 45.74,37.11 45.59,37.39 v44.98,38.54
TX  (via drill 0.55)
  Top 0.305: v48.37,22.18 48.37,26.23 48.66,26.77 U$3.14 | v48.22,11.2 v42.49,9.43
  Bottom 0.305: v48.37,22.18 v48.22,11.2 | 41.24,7.48 v42.49,9.43
  Bottom 0.356: GPS.4 34.2,5.87 35.94,7.57 41.24,7.48
TX2  (via drill 0.55)
  Top 0.356: U$1.6 40.51,53.04 40.25,51.51 41.02,50.12 42.16,49.74 v42.79,49.99 | v50.8,53.04 U$3.21
  Bottom 0.356: v50.8,53.04 48.98,53.37 44.15,50.83 v42.79,49.99
V+  (via drill 0.55)
  Top 0.762: SEFET.2 58.06,57.69 54.73,56.09 52.34,56.2 51.74,56.23 | 51.74,56.23 50.81,55.76 49.96,55.26 P-11226_2.2 P-11226.2 | DID.C COIL.P$1 31.65,62.23 32.3,61.58 33.22,61.58 33.27,61.62 35.9,61.62 36.79,60.73 36.79,59.83 37.87,58.75 v37.87,58.73 | 51.74,56.23 50.8,57.76 49.52,59.77 48.97,60.16 48.27,60.16 46.73,59.36 46.1,59.36 41.32,61.24 v41.07,61.37
  Top 1.27: SW-FET.2 R4.2 66.86,53.94 63.91,57.11 | G2.+ 63.91,57.11 | 63.91,57.11 63.45,57.66 61.66,57.77 SEFET.2
  Bottom 0.635: v37.87,58.73 39.67,59.77 v41.07,61.37
VCC/2
  Top 0.152: U$3.30
  Top 0.762: U$3.30 63.68,34.83 63.68,34.85 63.68,34.86 63.68,37.04 60.45,42.37 SW-FET.3 58.16,49.48 58.23,48.39 58.16,45.55 P-09322_1.1